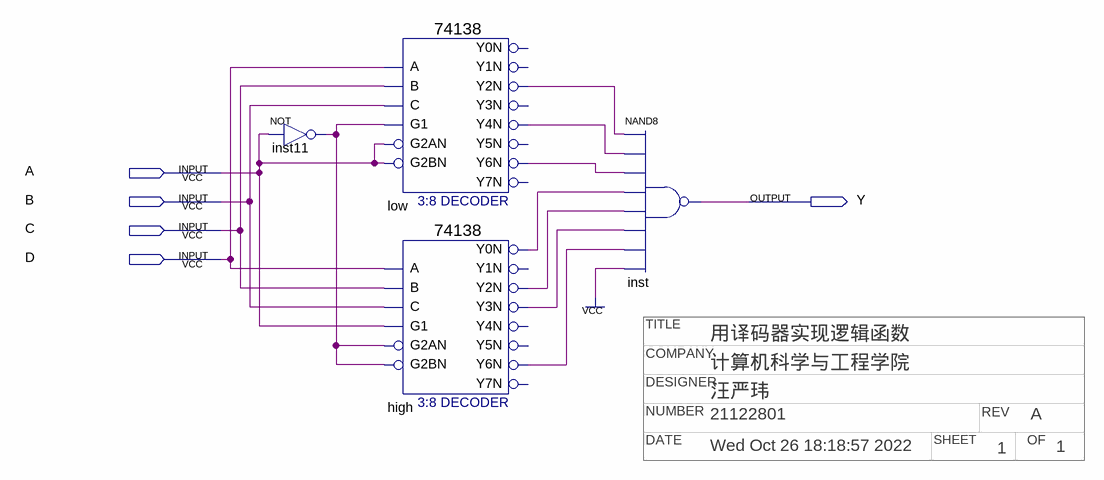
[diagram p0: schematic sheet]
// Quartus schematic 74LS138.bdf as structural Verilog: 4 symbols, 5 pins
// Title block: TITLE: 用译码器实现逻辑函数; COMPANY: 计算机科学与工程学院; DESIGNER: 汪严玮; NUMBER: 21122801; REV: A; DATE: Wed Oct 26 18:18:57 2022; SHEET: 1; OF: 1
module \74LS138  (
  input  A,
  input  B,
  input  C,
  input  D,
  output Y
);

  wire high_y0n, high_y2n, high_y3n, high_y6n, inst11_out, low_y2n, low_y4n, low_y6n;

  not inst11 (inst11_out, A);
  \74138  low (
    .A(D), .B(C), .G1(inst11_out), .C(B), .G2AN(A), .G2BN(A), .Y2N(low_y2n), .Y4N(low_y4n), .Y6N(low_y6n));  // open: Y0N, Y1N, Y3N, Y5N, Y7N
  \74138  high (
    .A(D), .B(C), .G1(A), .C(B), .G2AN(inst11_out), .G2BN(inst11_out), .Y0N(high_y0n), .Y2N(high_y2n),
    .Y3N(high_y3n), .Y6N(high_y6n));  // open: Y1N, Y4N, Y5N, Y7N
  nand inst (Y, low_y2n, low_y4n, low_y6n, high_y0n, high_y2n, high_y3n, high_y6n, 1'b1);
endmodule
